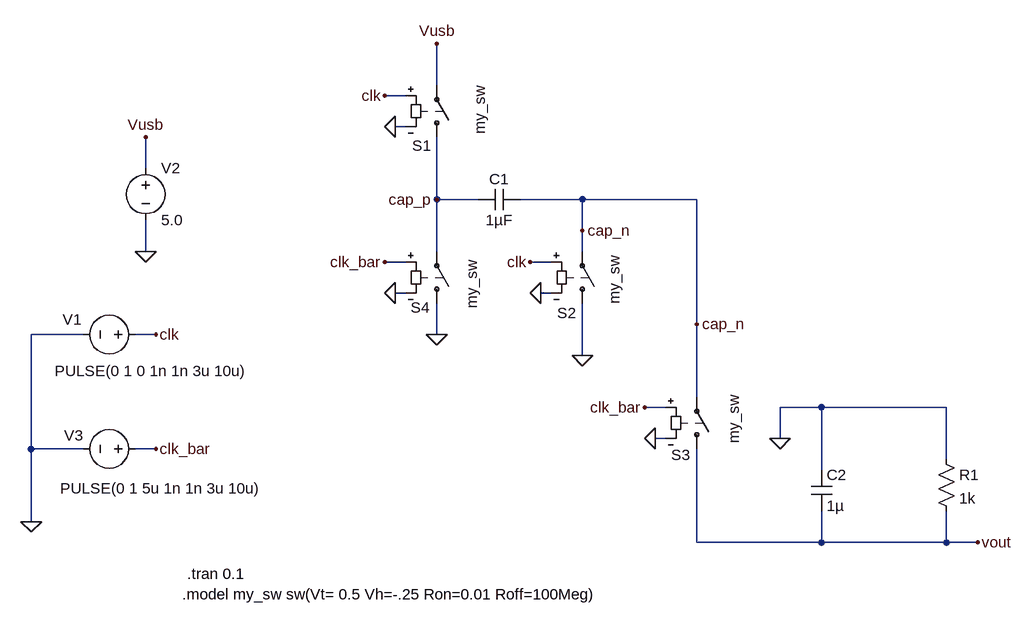
[diagram p0: schematic switch_cap_inverter.asc]
switch_cap_inverter.asc, the LTspice schematic file:
Version 4
SHEET 1 1348 696
WIRE 256 -784 256 -848
WIRE 208 -768 176 -768
WIRE 208 -720 192 -720
WIRE -192 -656 -192 -704
WIRE 256 -608 256 -704
WIRE 320 -608 256 -608
WIRE 480 -608 384 -608
WIRE 656 -608 480 -608
WIRE 480 -560 480 -608
WIRE -192 -528 -192 -576
WIRE 256 -528 256 -608
WIRE 480 -528 480 -560
WIRE 208 -512 176 -512
WIRE 432 -512 400 -512
WIRE 208 -464 192 -464
WIRE 432 -464 416 -464
WIRE 656 -416 656 -608
WIRE -288 -400 -368 -400
WIRE -176 -400 -208 -400
WIRE 256 -400 256 -448
WIRE 480 -368 480 -448
WIRE 656 -304 656 -416
WIRE 608 -288 576 -288
WIRE 848 -288 784 -288
WIRE 1040 -288 848 -288
WIRE 608 -240 592 -240
WIRE 784 -240 784 -288
WIRE -368 -224 -368 -400
WIRE -288 -224 -368 -224
WIRE -176 -224 -208 -224
WIRE 1040 -208 1040 -288
WIRE 848 -192 848 -288
WIRE -368 -112 -368 -224
WIRE 656 -80 656 -224
WIRE 848 -80 848 -128
WIRE 848 -80 656 -80
WIRE 1040 -80 1040 -128
WIRE 1040 -80 848 -80
WIRE 1088 -80 1040 -80
FLAG -176 -400 clk
FLAG 192 -720 0
FLAG 176 -768 clk
FLAG -192 -528 0
FLAG -192 -704 Vusb
FLAG 256 -848 Vusb
FLAG 784 -240 0
FLAG 416 -464 0
FLAG -368 -112 0
FLAG -176 -224 clk_bar
FLAG 256 -608 cap_p
FLAG 480 -560 cap_n
FLAG 480 -368 0
FLAG 592 -240 0
FLAG 576 -288 clk_bar
FLAG 656 -416 cap_n
FLAG 400 -512 clk
FLAG 192 -464 0
FLAG 176 -512 clk_bar
FLAG 256 -400 0
FLAG 1088 -80 vout
SYMBOL sw 256 -688 M180
WINDOW 0 -38 3 Left 2
WINDOW 3 66 95 VLeft 2
SYMATTR InstName S1
SYMATTR Value my_sw
SYMBOL voltage -192 -400 R90
WINDOW 123 0 0 Left 2
WINDOW 39 0 0 Left 2
WINDOW 3 56 -157 VRight 2
WINDOW 0 -23 98 VRight 2
SYMATTR Value PULSE(0 1 0 1n 1n 3u 10u)
SYMATTR InstName V1
SYMBOL cap 320 -592 R270
WINDOW 0 32 32 VTop 2
WINDOW 3 0 32 VBottom 2
SYMATTR InstName C1
SYMATTR Value 1µF
SYMBOL voltage -192 -672 R0
WINDOW 123 0 0 Left 2
WINDOW 39 0 0 Left 2
SYMATTR InstName V2
SYMATTR Value 5.0
SYMBOL cap 832 -192 R0
SYMATTR InstName C2
SYMATTR Value 1µ
SYMBOL sw 480 -432 M180
WINDOW 0 -39 1 Left 2
WINDOW 3 49 90 VLeft 2
SYMATTR InstName S2
SYMATTR Value my_sw
SYMBOL voltage -192 -224 R90
WINDOW 123 0 0 Left 2
WINDOW 39 0 0 Left 2
WINDOW 3 61 -179 VRight 2
WINDOW 0 -21 96 VRight 2
SYMATTR Value PULSE(0 1 5u 1n 1n 3u 10u)
SYMATTR InstName V3
SYMBOL sw 656 -208 M180
WINDOW 0 -39 7 Left 2
WINDOW 3 57 99 VLeft 2
SYMATTR InstName S3
SYMATTR Value my_sw
SYMBOL sw 256 -432 M180
WINDOW 0 -40 10 Left 2
WINDOW 3 54 8 VRight 2
SYMATTR InstName S4
SYMATTR Value my_sw
SYMBOL res 1024 -224 R0
SYMATTR InstName R1
SYMATTR Value 1k
TEXT -136 0 Left 2 !.model my_sw sw(Vt= 0.5 Vh=-.25 Ron=0.01 Roff=100Meg)
TEXT -128 -32 Left 2 !.tran 0.1

The netlist it stands for:
* switch_cap_inverter.asc
S1 cap_p Vusb clk 0 my_sw
V1 clk 0 PULSE(0 1 0 1n 1n 3u 10u)
C1 cap_p cap_n 1µF
V2 Vusb 0 5.0
C2 0 vout 1µ
S2 0 cap_n clk 0 my_sw
V3 clk_bar 0 PULSE(0 1 5u 1n 1n 3u 10u)
S3 vout cap_n clk_bar 0 my_sw
S4 0 cap_p clk_bar 0 my_sw
R1 0 vout 1k
.model my_sw sw(Vt= 0.5 Vh=-.25 Ron=0.01 Roff=100Meg)
.tran 0.1
.backanno
.end